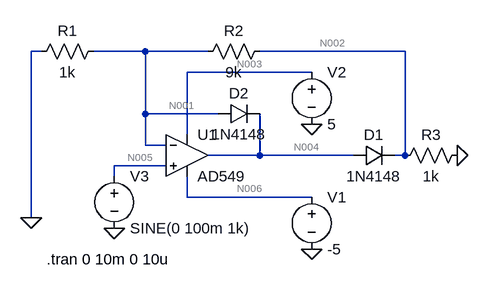
[diagram p0: schematic rectifier-gain.asc]
rectifier-gain.asc, the LTspice schematic file:
Version 4
SHEET 1 880 680
WIRE -48 0 -64 0
WIRE 112 0 32 0
WIRE 208 0 112 0
WIRE 512 0 288 0
WIRE 368 32 176 32
WIRE 112 96 112 0
WIRE 224 96 112 96
WIRE 176 128 176 32
WIRE 112 144 112 96
WIRE 144 144 112 144
WIRE 288 160 288 96
WIRE 288 160 208 160
WIRE 432 160 288 160
WIRE 512 160 512 0
WIRE 512 160 496 160
WIRE 144 176 64 176
WIRE 64 192 64 176
WIRE 176 224 176 192
WIRE 368 224 176 224
WIRE -64 256 -64 0
FLAG 368 112 0
FLAG 368 304 0
FLAG -64 256 0
FLAG 64 272 0
FLAG 592 160 0
SYMBOL OpAmps\\AD549 176 96 R0
SYMATTR InstName U1
SYMBOL voltage 368 208 R0
WINDOW 123 0 0 Left 0
WINDOW 39 0 0 Left 0
SYMATTR InstName V1
SYMATTR Value -5
SYMBOL voltage 368 16 R0
WINDOW 123 0 0 Left 0
WINDOW 39 0 0 Left 0
SYMATTR InstName V2
SYMATTR Value 5
SYMBOL voltage 64 176 R0
WINDOW 123 0 0 Left 0
WINDOW 39 0 0 Left 0
SYMATTR InstName V3
SYMATTR Value SINE(0 100m 1k)
SYMBOL res 48 -16 R90
WINDOW 0 0 56 VBottom 2
WINDOW 3 32 56 VTop 2
SYMATTR InstName R1
SYMATTR Value 1k
SYMBOL res 304 -16 R90
WINDOW 0 0 56 VBottom 2
WINDOW 3 32 56 VTop 2
SYMATTR InstName R2
SYMATTR Value 9k
SYMBOL diode 432 176 R270
WINDOW 0 32 32 VTop 2
WINDOW 3 0 32 VBottom 2
SYMATTR InstName D1
SYMATTR Value 1N4148
SYMBOL diode 224 112 R270
WINDOW 0 32 32 VTop 2
WINDOW 3 0 32 VBottom 2
SYMATTR InstName D2
SYMATTR Value 1N4148
SYMBOL res 608 144 R90
WINDOW 0 0 56 VBottom 2
WINDOW 3 32 56 VTop 2
SYMATTR InstName R3
SYMATTR Value 1k
TEXT -40 320 Left 2 !.tran 0 10m 0 10u

The netlist it stands for:
* rectifier-gain.asc
XU1 N005 N001 N003 N006 N004 AD549  ; pins In+ In- V+ V- OUT
V1 N006 0 -5
V2 N003 0 5
V3 N005 0 SINE(0 100m 1k)
R1 N001 0 1k
R2 N002 N001 9k
D1 N004 N002 1N4148
D2 N001 N004 1N4148
R3 0 N002 1k
.model D D
.lib standard.dio
.tran 0 10m 0 10u
.backanno
.end

* Results of the author's LTspice run, read from the files saved beside the schematic
* Operating Point, zero values left out:
*   V(n001) = -353.6 nV
*   V(n003) = 5 V
*   V(n004) = -6.014 mV
*   V(n006) = -5 V
*   V(n002) = -317.2 nV
*   I(D2) = 357.7 pA
*   I(D1) = -313.2 pA
*   I(R3) = 317.2 pA
*   I(R2) = 4.041 pA
*   I(R1) = -353.6 pA
*   I(V2) = -794.4 µA
*   I(V1) = 794.4 µA
*   Ix(u1:3) = 794.4 µA
*   Ix(u1:4) = -794.4 µA
*   Ix(u1:5) = 670.9 pA
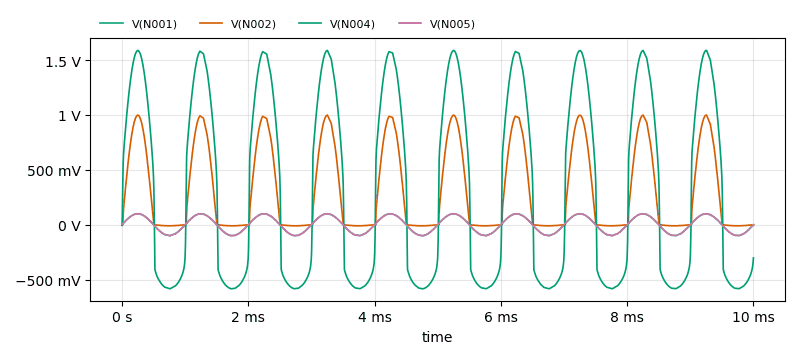
[diagram p1: Transient Analysis of rectifier-gain.asc, plotted from the saved traces]
* Transient Analysis, 1 run:
*   V(N001): min -99.73 mV, max 99.98 mV, average 162.6 µV, rms 70.26 mV, last -1.692 mV
*   V(N002): min -9.975 mV, max 999.8 mV, average 312.7 mV, rms 498.2 mV, last -136.2 µV
*   V(N004): min -583.8 mV, max 1.589 V, average 337.6 mV, rms 948.1 mV, last -302.5 mV
*   V(N005): min -99.78 mV, max 99.99 mV, average 164.6 µV, rms 70.33 mV, last 0 V